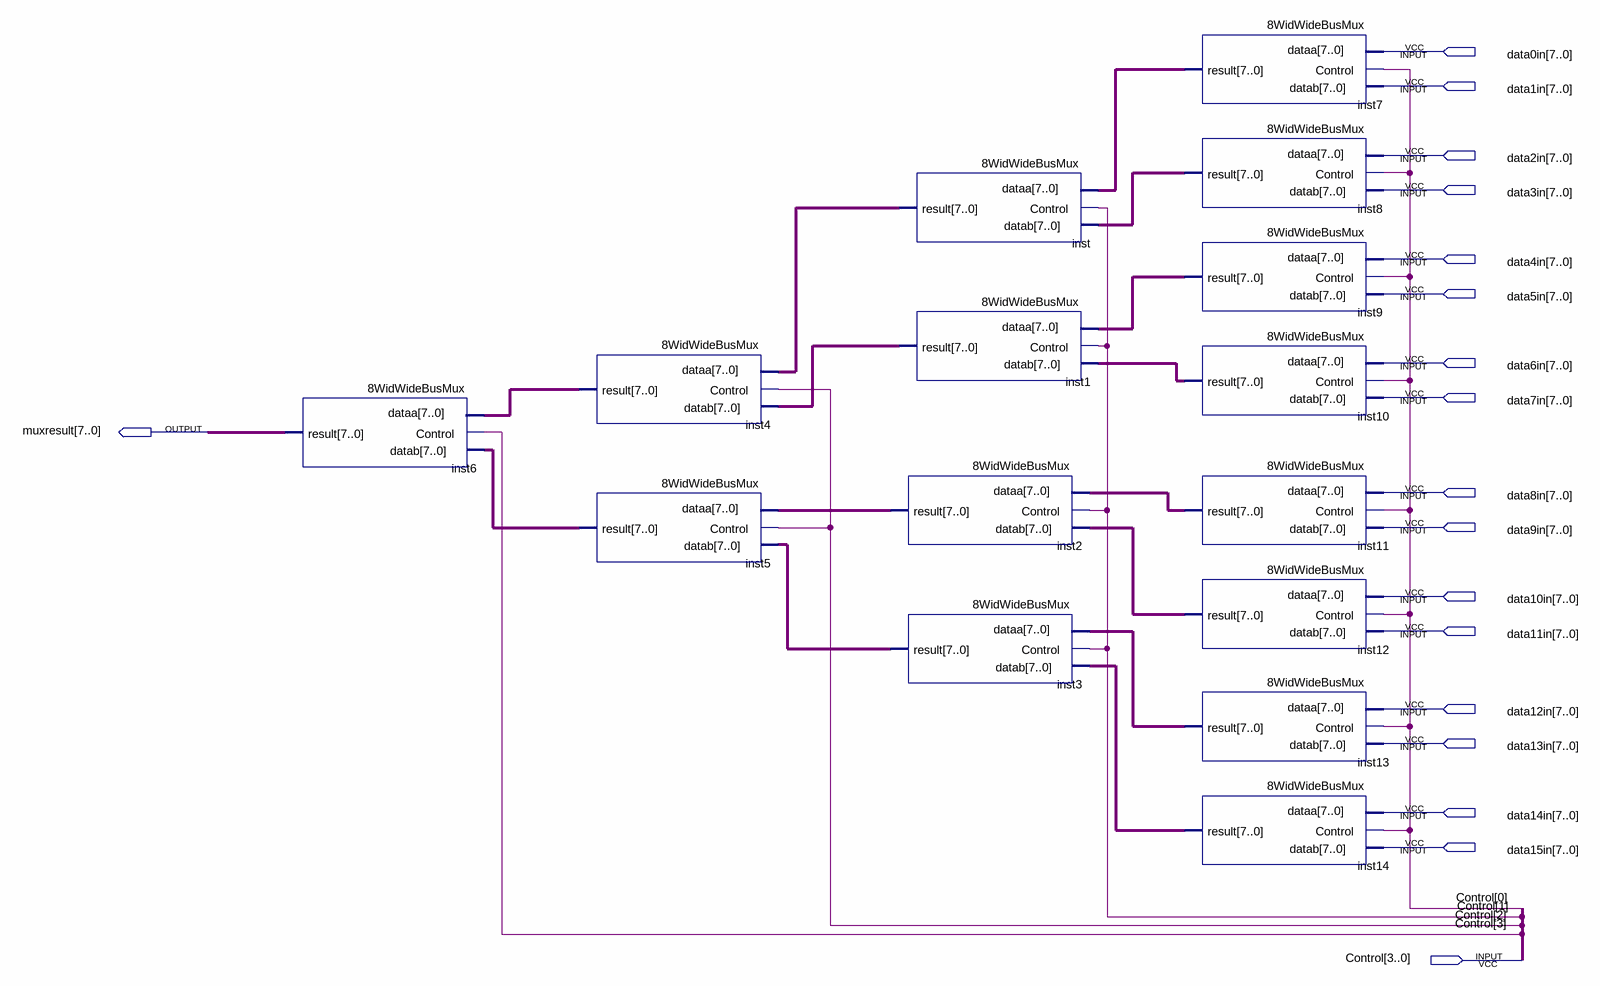
[diagram p0: schematic sheet]
// Quartus schematic 8wide16to1BusMUX.bdf as structural Verilog: 15 symbols, 18 pins
module \8wide16to1BusMUX  (
  input  [7:0] data0in,
  input  [7:0] data1in,
  input  [7:0] data2in,
  input  [7:0] data3in,
  input  [7:0] data4in,
  input  [7:0] data5in,
  input  [7:0] data6in,
  input  [7:0] data7in,
  input  [7:0] data8in,
  input  [7:0] data9in,
  input  [7:0] data10in,
  input  [7:0] data11in,
  input  [7:0] data12in,
  input  [7:0] data13in,
  input  [7:0] data14in,
  input  [7:0] data15in,
  input  [3:0] Control,
  output [7:0] muxresult
);

  wire [7:0] inst1_result, inst2_result, inst3_result, inst4_result, inst5_result, inst7_result,
       inst8_result, inst9_result, inst10_result, inst11_result, inst12_result, inst13_result, inst14_result,
       inst_result;

  \8WidWideBusMux  inst6 (.Control(Control[3]), .dataa(inst4_result), .datab(inst5_result), .result(muxresult));
  \8WidWideBusMux  inst4 (.Control(Control[2]), .dataa(inst_result), .datab(inst1_result), .result(inst4_result));
  \8WidWideBusMux  inst5 (.Control(Control[2]), .dataa(inst2_result), .datab(inst3_result), .result(inst5_result));
  \8WidWideBusMux  inst (.Control(Control[1]), .dataa(inst7_result), .datab(inst8_result), .result(inst_result));
  \8WidWideBusMux  inst1 (.Control(Control[1]), .dataa(inst9_result), .datab(inst10_result), .result(inst1_result));
  \8WidWideBusMux  inst2 (.Control(Control[1]), .dataa(inst11_result), .datab(inst12_result), .result(inst2_result));
  \8WidWideBusMux  inst3 (.Control(Control[1]), .dataa(inst13_result), .datab(inst14_result), .result(inst3_result));
  \8WidWideBusMux  inst7 (.Control(Control[0]), .dataa(data0in), .datab(data1in), .result(inst7_result));
  \8WidWideBusMux  inst8 (.Control(Control[0]), .dataa(data2in), .datab(data3in), .result(inst8_result));
  \8WidWideBusMux  inst9 (.Control(Control[0]), .dataa(data4in), .datab(data5in), .result(inst9_result));
  \8WidWideBusMux  inst10 (.Control(Control[0]), .dataa(data6in), .datab(data7in), .result(inst10_result));
  \8WidWideBusMux  inst11 (.Control(Control[0]), .dataa(data8in), .datab(data9in), .result(inst11_result));
  \8WidWideBusMux  inst12 (.Control(Control[0]), .dataa(data10in), .datab(data11in), .result(inst12_result));
  \8WidWideBusMux  inst13 (.Control(Control[0]), .dataa(data12in), .datab(data13in), .result(inst13_result));
  \8WidWideBusMux  inst14 (.Control(Control[0]), .dataa(data14in), .datab(data15in), .result(inst14_result));
endmodule
